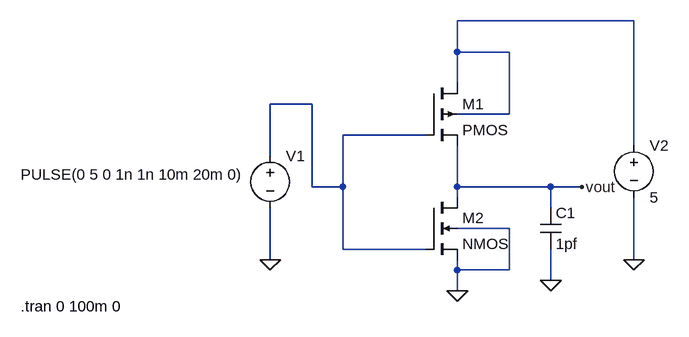
[diagram p0: schematic CMOS_Inverter.asc]
CMOS_Inverter.asc, the LTspice schematic file:
Version 4.1
SHEET 1 880 680
WIRE 416 -32 144 -32
WIRE 144 16 144 -32
WIRE 224 16 144 16
WIRE 144 64 144 16
WIRE -80 96 -144 96
WIRE 224 112 224 16
WIRE 224 112 144 112
WIRE 96 144 -32 144
WIRE 416 160 416 -32
WIRE -144 176 -144 96
WIRE -80 224 -80 96
WIRE -32 224 -32 144
WIRE -32 224 -80 224
WIRE 144 224 144 160
WIRE 288 224 144 224
WIRE 336 224 288 224
WIRE 144 240 144 224
WIRE 288 256 288 224
WIRE 224 288 144 288
WIRE -32 320 -32 224
WIRE 96 320 -32 320
WIRE -144 336 -144 256
WIRE 416 336 416 240
WIRE 144 352 144 336
WIRE 224 352 224 288
WIRE 224 352 144 352
WIRE 288 368 288 320
WIRE 144 384 144 352
FLAG 144 384 0
FLAG -144 336 0
FLAG 416 336 0
FLAG 336 224 vout
FLAG 288 368 0
SYMBOL pmos4 96 64 R0
SYMATTR InstName M1
SYMBOL nmos4 96 240 R0
SYMATTR InstName M2
SYMBOL voltage -144 160 R0
WINDOW 3 -384 45 Left 2
WINDOW 123 0 0 Left 0
WINDOW 39 0 0 Left 0
SYMATTR Value PULSE(0 5 0 1n 1n 10m 20m 0)
SYMATTR InstName V1
SYMBOL voltage 416 144 R0
WINDOW 123 0 0 Left 0
WINDOW 39 0 0 Left 0
SYMATTR InstName V2
SYMATTR Value 5
SYMBOL cap 272 256 R0
SYMATTR InstName C1
SYMATTR Value 1pf
TEXT -528 408 Left 2 !.tran 0 100m 0

The netlist it stands for:
* CMOS_Inverter.asc
M1 N001 N002 vout N001 PMOS
M2 vout N002 0 0 NMOS
V1 N002 0 PULSE(0 5 0 1n 1n 10m 20m 0)
V2 N001 0 5
C1 vout 0 1pf
.model NMOS NMOS
.model PMOS PMOS
.lib standard.mos
.tran 0 100m 0
.backanno
.end